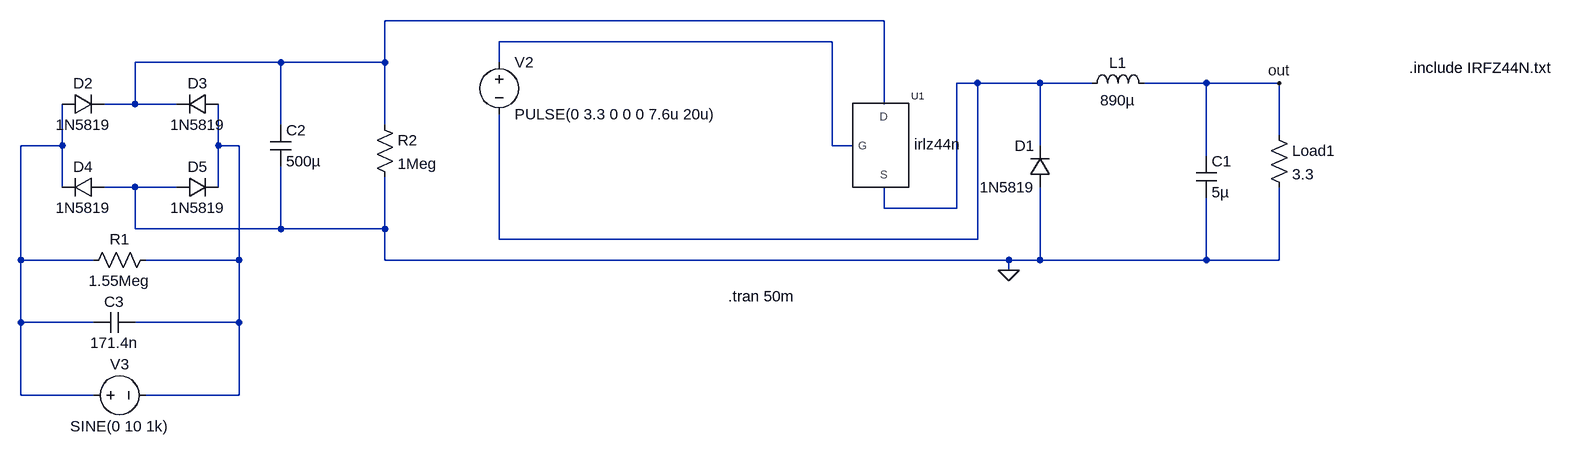
[diagram p0: schematic FINAL.asc]
FINAL.asc, the LTspice schematic file:
Version 4.1
SHEET 1 972 680
WIRE -80 -80 -848 -80
WIRE -160 -48 -672 -48
WIRE -1008 -16 -1232 -16
WIRE -848 -16 -848 -80
WIRE -848 -16 -1008 -16
WIRE -672 -16 -672 -48
WIRE 64 16 32 16
WIRE 160 16 64 16
WIRE 240 16 160 16
WIRE 416 16 320 16
WIRE 528 16 416 16
WIRE -1232 48 -1232 -16
WIRE -1232 48 -1280 48
WIRE -1168 48 -1232 48
WIRE -80 48 -80 -80
WIRE -1008 80 -1008 -16
WIRE -848 80 -848 -16
WIRE 528 96 528 16
WIRE -1344 112 -1344 48
WIRE -1344 112 -1408 112
WIRE -1104 112 -1104 48
WIRE -1072 112 -1104 112
WIRE -160 112 -160 -48
WIRE -128 112 -160 112
WIRE 160 112 160 16
WIRE 416 128 416 16
WIRE -1344 176 -1344 112
WIRE -1232 176 -1280 176
WIRE -1168 176 -1232 176
WIRE -1104 176 -1104 112
WIRE -80 208 -80 176
WIRE 32 208 32 16
WIRE 32 208 -80 208
WIRE -1232 240 -1232 176
WIRE -1008 240 -1008 144
WIRE -1008 240 -1232 240
WIRE -848 240 -848 160
WIRE -848 240 -1008 240
WIRE -672 256 -672 64
WIRE 64 256 64 16
WIRE 64 256 -672 256
WIRE -1408 288 -1408 112
WIRE -1296 288 -1408 288
WIRE -1072 288 -1072 112
WIRE -1072 288 -1216 288
WIRE -848 288 -848 240
WIRE 112 288 -848 288
WIRE 160 288 160 176
WIRE 160 288 112 288
WIRE 416 288 416 192
WIRE 416 288 160 288
WIRE 528 288 528 176
WIRE 528 288 416 288
WIRE 112 304 112 288
WIRE -1408 384 -1408 288
WIRE -1296 384 -1408 384
WIRE -1072 384 -1072 288
WIRE -1072 384 -1232 384
WIRE -1408 496 -1408 384
WIRE -1296 496 -1408 496
WIRE -1072 496 -1072 384
WIRE -1072 496 -1216 496
FLAG 528 16 out
FLAG 112 304 0
SYMBOL ind 224 32 R270
WINDOW 0 32 56 VTop 2
WINDOW 3 5 56 VBottom 2
SYMATTR InstName L1
SYMATTR Value 890µ
SYMBOL cap 400 128 R0
SYMATTR InstName C1
SYMATTR Value 5µ
SYMBOL IRZ 80 144 R0
SYMATTR InstName U1
SYMBOL voltage -672 -32 R0
WINDOW 123 0 0 Left 0
WINDOW 39 0 0 Left 0
SYMATTR InstName V2
SYMATTR Value PULSE(0 3.3 0 0 0 7.6u 20u)
SYMBOL diode 176 176 R180
WINDOW 0 24 64 Left 2
WINDOW 3 24 0 Left 2
SYMATTR InstName D1
SYMATTR Value 1N5819
SYMBOL res 512 80 R0
SYMATTR InstName Load1
SYMATTR Value 3.3
SYMBOL diode -1344 64 R270
WINDOW 0 32 32 VTop 2
WINDOW 3 0 32 VBottom 2
SYMATTR InstName D2
SYMATTR Value 1N5819
SYMBOL diode -1104 32 R90
WINDOW 0 0 32 VBottom 2
WINDOW 3 32 32 VTop 2
SYMATTR InstName D3
SYMATTR Value 1N5819
SYMBOL diode -1280 160 R90
WINDOW 0 0 32 VBottom 2
WINDOW 3 32 32 VTop 2
SYMATTR InstName D4
SYMATTR Value 1N5819
SYMBOL diode -1168 192 R270
WINDOW 0 32 32 VTop 2
WINDOW 3 0 32 VBottom 2
SYMATTR InstName D5
SYMATTR Value 1N5819
SYMBOL cap -1024 80 R0
SYMATTR InstName C2
SYMATTR Value 500µ
SYMBOL res -864 64 R0
SYMATTR InstName R2
SYMATTR Value 1Meg
SYMBOL res -1200 272 R90
WINDOW 0 0 56 VBottom 2
WINDOW 3 32 56 VTop 2
SYMATTR InstName R1
SYMATTR Value 1.55Meg
SYMBOL cap -1232 368 R90
WINDOW 0 0 32 VBottom 2
WINDOW 3 32 32 VTop 2
SYMATTR InstName C3
SYMATTR Value 171.4n
SYMBOL voltage -1312 496 R270
WINDOW 0 32 56 VTop 2
WINDOW 3 -32 56 VBottom 2
WINDOW 123 0 0 Left 0
WINDOW 39 0 0 Left 0
SYMATTR InstName V3
SYMATTR Value SINE(0 10 1k)
TEXT -320 344 Left 2 !.tran 50m
TEXT 728 -8 Left 2 !.include IRFZ44N.txt

The netlist it stands for:
* FINAL.asc
L1 N003 out 890µ
C1 out 0 5µ
X§U1 N001 N002 N003 irlz44n  ; pins D G S
V2 N002 N003 PULSE(0 3.3 0 0 0 7.6u 20u)
D1 0 N003 1N5819
R§Load1 out 0 3.3
D2 N004 N001 1N5819
D3 N005 N001 1N5819
D4 0 N004 1N5819
D5 0 N005 1N5819
C2 N001 0 500µ
R2 N001 0 1Meg
R1 N005 N004 1.55Meg
C3 N005 N004 171.4n
V3 N004 N005 SINE(0 10 1k)
.model D D
.lib standard.dio
.tran 50m
.include IRFZ44N.txt
.backanno
.end